# Altium schematic sheet 100_Power Supply.SchDoc: Power
size A4; SheetNumber: 3; SheetTotal: 7
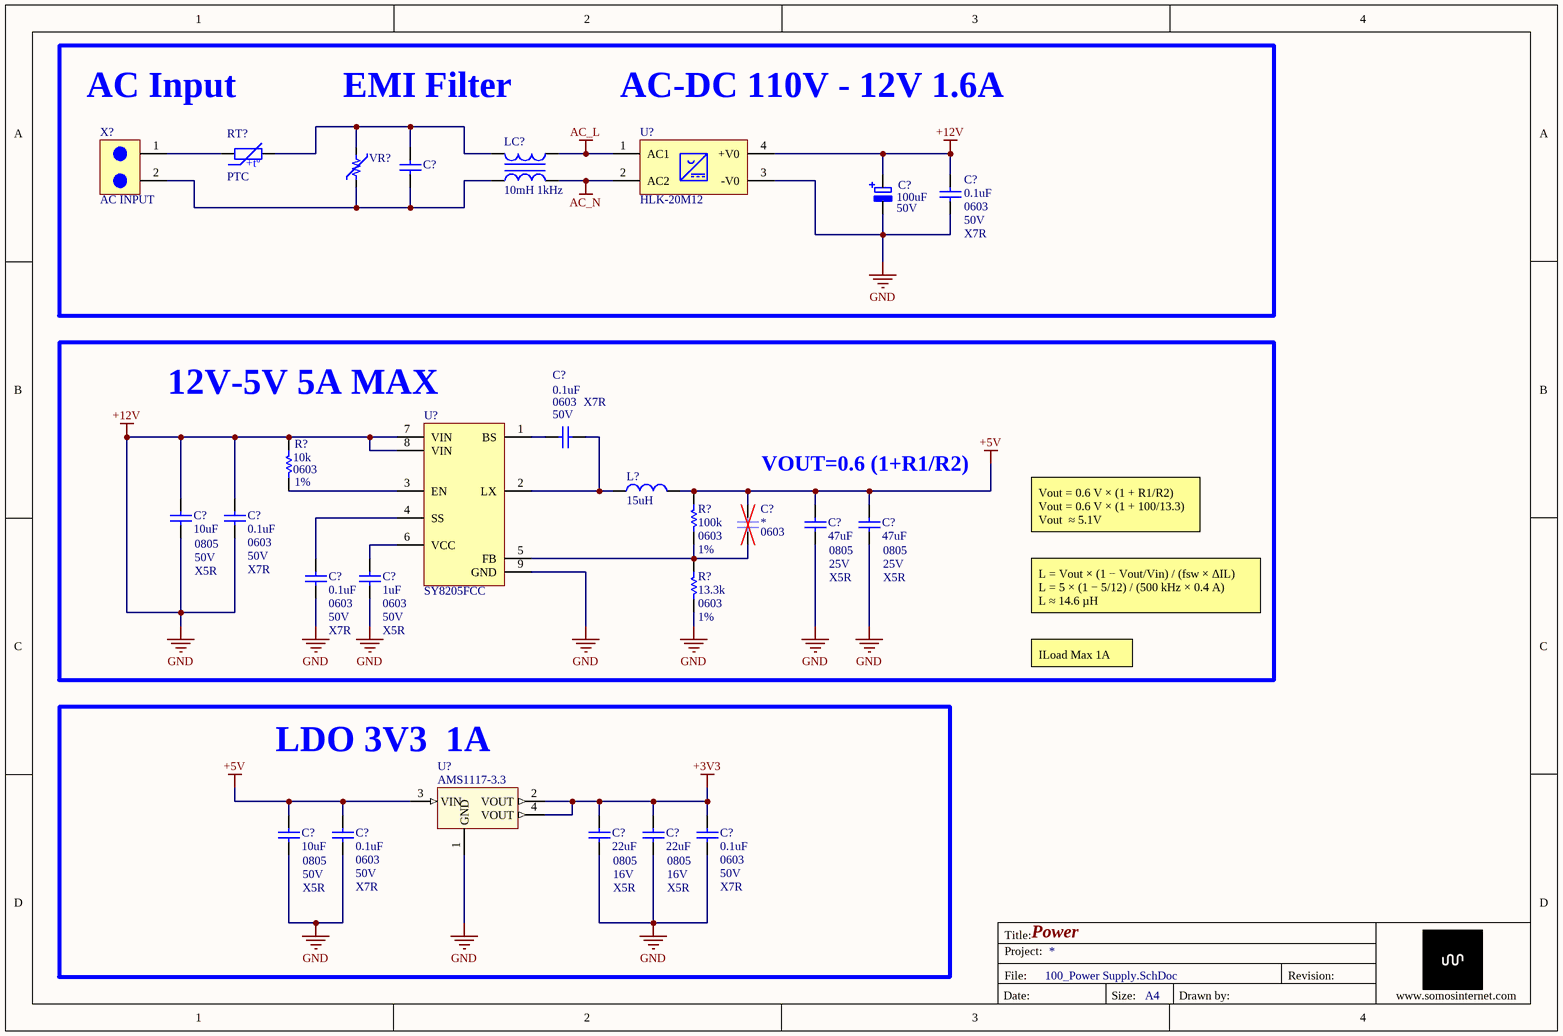
[diagram p0: 100_Power Supply.SchDoc]

## Parts
(Parts that share a designator on the sheet are numbered #1, #2 ... from top to bottom, then left to right.)
C?#1  C42Q322448P40001  [Safety Capacitor TH,P=10mm]  (value not drawn)
C?#2  0.1uF  PackageReference: 0603  Voltage: 50V  Temperature Coeficient: X7R  [CAPC1608X05N[0603]]
C?#3  100uF  Voltage: 50V  [CAP ALUM 8.3MM]
C?#4  0.1uF  PackageReference: 0603  Voltage: 50V  Temperature Coeficient: X7R  [CAPC1608X05N[0603]]
C?#5  0.1uF  PackageReference: 0603  Voltage: 50V  Temperature Coeficient: X7R  [CAPC1608X05N[0603]]
C?#6  *  PackageReference: 0603  [CAPC1608X05N[0603]]
C?#7  10uF  PackageReference: 0805  Voltage: 50V  Temperature Coeficient: X5R  [CAPC2012X05N[0805]]
C?#8  47uF  PackageReference: 0805  Voltage: 25V  Temperature Coeficient: X5R  [CAPC2012X05N[0805]]
C?#9  47uF  PackageReference: 0805  Voltage: 25V  Temperature Coeficient: X5R  [CAPC2012X05N[0805]]
C?#10  0.1uF  PackageReference: 0603  Voltage: 50V  Temperature Coeficient: X7R  [CAPC1608X05N[0603]]
C?#11  1uF  PackageReference: 0603  Voltage: 50V  Temperature Coeficient: X5R  [CAPC1608X05N[0603]]
C?#12  0.1uF  PackageReference: 0603  Voltage: 50V  Temperature Coeficient: X7R  [CAPC1608X05N[0603]]
C?#13  0.1uF  PackageReference: 0603  Voltage: 50V  Temperature Coeficient: X7R  [CAPC1608X05N[0603]]
C?#14  10uF  PackageReference: 0805  Voltage: 50V  Temperature Coeficient: X5R  [CAPC2012X05N[0805]]
C?#15  22uF  PackageReference: 0805  Voltage: 16V  Temperature Coeficient: X5R  [CAPC2012X05N[0805]]
C?#16  22uF  PackageReference: 0805  Voltage: 16V  Temperature Coeficient: X5R  [CAPC2012X05N[0805]]
L?  15uH  [SRN5020TA]
LC?  value 10mH 1kHz  [LC_10mH_1kHz_0.7A]  (hidden comment: PDUUAT98-103MLN)
R?#1  10k  PackageReference: 0603  Tolerance: 1%  [RESC1608X05N[0603]]
R?#2  100k  PackageReference: 0603  Tolerance: 1%  [RESC1608X05N[0603]]
R?#3  13.3k  PackageReference: 0603  Tolerance: 1%  [RESC1608X05N[0603]]
RT?  PTC  [POLYSW200-5638-310]
U?#1  HLK-20M12  [DIP,56x32mm]
U?#2  SY8205FCC  [SOIC127P600X160_HS-9N]
U?#3  AMS1117-3.3  [4-SOT_223]
VR?  175VAC 2.5kA  [Varistor FTR10D271K]  (value not drawn)
X?  AC INPUT  [TH,Right Angle,P=5mm]

## Blocks framed on the sheet
12V-5V 5A MAX: C?#4-C?#11 L? R?#1-R?#3 U?#2
LDO 3V3  1A: C?#12-C?#16 U?#3

## Nets
+3V3: C?#13.1 C?#15.2 C?#16.2 U?#3.2(VOUT) U?#3.4(VOUT)
+5V: C?#6.2 C?#8.2 C?#9.2 C?#12.1 C?#14.2 L?.2 R?#2.2 U?#3.3(VIN)
+12V: C?#2.1 C?#2.2 C?#3.+ C?#3.- C?#5.1 C?#5.2 C?#7.1 C?#7.2 C?#8.1 C?#9.1 C?#10.2 C?#11.1 C?#12.2 C?#13.2 C?#14.1 C?#15.1 C?#16.1 R?#1.2 R?#3.1 U?#1.3(-V0) U?#1.4(+V0) U?#2.7(VIN) U?#2.8(VIN) U?#2.9(GND) U?#3.1(GND)  [also labelled GND]
AC_L: LC?.4 U?#1.1(AC1)
AC_N: LC?.3 U?#1.2(AC2)
NetC?#1_1: C?#1.1 LC?.2 VR?.1 X?.2
NetC?#1_2: C?#1.2 LC?.1 RT?.2 VR?.2
NetC?#4_1: C?#4.1 L?.1 U?#2.2(LX)
NetC?#4_2: C?#4.2 U?#2.1(BS)
NetC?#6_1: C?#6.1 R?#2.1 R?#3.2 U?#2.5(FB)
NetC?#10_1: C?#10.1 U?#2.4(SS)
NetC?#11_2: C?#11.2 U?#2.6(VCC)
NetR?#1_1: R?#1.1 U?#2.3(EN)
NetRT?_1: RT?.1 X?.1

## Notes on the sheet
- AC Input
- EMI Filter
- (near U?#1) AC-DC 110V - 12V 1.6A
- (near C?#9) VOUT=0.6 (1+R1/R2)
- Vout = 0.6 V × (1 + R1/R2)
  Vout = 0.6 V × (1 + 100/13.3)
  Vout  ≈ 5.1V
- L = Vout × (1 − Vout/Vin) / (fsw × ΔIL)
  L = 5 × (1 − 5/12) / (500 kHz × 0.4 A)
  L ≈ 14.6 µH
- ILoad Max 1A
- Title:
- Project:
- File:
- Revision:
- Date:
- Size:
- A4
- Drawn by:
- www.somosinternet.com <http://www.somosinternet.com>
- (in symbol PTC) +tº

## Library data of the parts
C?#1 = Safety Capacitor C42Q322448P40001: CAP SAFETY 220nF ±10% 275V 310V TH; Manufacturer: WALSON; Manufacturer Part Number: C42Q322448P40001; Supplier 1: LCSC; Supplier Part Number 1: C46638866; ComponentLink1Description: LCSC; ComponentLink1URL: https://www.lcsc.com/product-detail/C46638866.html
C?#2 C?#4 C?#5 C?#10-C?#13 = CAP-generic: Chip Ceramic Capacitor SMD; Populated: Yes; Manuf1: *; Manuf2: *; Manuf1Partnumber: *; Manuf2Partnumber: *; ClassName: *; ROHS: Yes; LifeCycle: Checked; HelpURL: *
  C?#2 C?#4 C?#5 C?#10 C?#12 C?#13: Value: 0.1uF; LCSC: C113803
  C?#11: Value: 1uF; Supplier 1: DigiKey; Supplier Part Number 1: 490-GRM155R61H105ME05DDKR-ND; LCSC: C128624
C?#3 = CAPPOL-generic: Polarized Capacitor SMD; Manufacturer: JIERR; Manufacturer Part Number: RV50V100M8X10; Populated: Yes; Value: 100uF; ClassName: *; ROHS: Yes; LifeCycle: Checked; HelpURL: *; Supplier 1: Digikey; Supplier Part Number 1: 493-9631-1-ND; LCSC: C48935390
C?#6 = DNP-CAP: (DNP) "Do Not Populate" Chip Ceramic Capacitor SMD; Populated: No; Value: *; Manuf1: *; Manuf2: *; Manuf1Partnumber: *; Manuf2Partnumber: *; ClassName: *; ROHS: Yes; LifeCycle: Checked; HelpURL: *; Voltage: *
C?#7 C?#14 = CAP-generic: Chip Ceramic Capacitor SMD; Manuf1: muRata; Manuf1Partnumber: GRM21BR61H106KE43L; Populated: Yes; Value: 10uF; Manuf2: *; Manuf2Partnumber: *; ClassName: *; ROHS: Yes; LifeCycle: Checked; HelpURL: *; LCSC: C440198
C?#8 C?#9 = CAP-generic: Chip Ceramic Capacitor SMD; Manuf1: Samsung Electro-Mechanics; Manuf1Partnumber: CL21A476MQYNNNE; Populated: Yes; Value: 47uF; Manuf2: *; Manuf2Partnumber: *; ClassName: *; ROHS: Yes; LifeCycle: Checked; HelpURL: *; LCSC: C16780
C?#15 C?#16 = CAP-generic: Chip Ceramic Capacitor SMD; Manuf1: Samsung Electro-Mechanics; Manuf1Partnumber: CL21A226MOQNNNE; Populated: Yes; Value: 22uF; Manuf2: *; Manuf2Partnumber: *; ClassName: *; ROHS: Yes; LifeCycle: Checked; HelpURL: *; LCSC: C98190
L? = SRN5020TA-120M: FIXED IND 12UH 1.4A 135 MOHM SMD; Manufacturer 1: cjiang; Manufacturer Part Number 1: FNR5020S150MT; Supplier 1: LCSC; ComponentLink1URL: https://www.lcsc.com/product-detail/C167939.html; ComponentLink1Description: LCSC; Supplier Part Number 1: C167939; Value: 15uH
LC? = LC_10mH_1kHz_0.7A: CMC 1.5A 2LN 1.4KOHM SMD; Manufacturer: PROD Tech; Manufacturer Part Number: PDUUAT98-103MLN; ComponentLink1Description: Digi-Key; ComponentLink1URL: https://www.digikey.com/en/products/detail/murata-electronics/DLW5BTH142TQ2L/7564115; Supplier 1: LCSC; Supplier Part Number 1: C2909797
R?#1 = RES-generic: Chip Resistor SMD; Populated: Yes; Value: 10k; Manuf1: *; Manuf2: *; Manuf1Partnumber: *; Manuf2Partnumber: *; ClassName: *; ROHS: Yes; LifeCycle: Checked; HelpURL: *; Power: *; Supplier 1: Digikey; Supplier Part Number 1: 1276-3431-1-ND; LCSC: C5139509
R?#2 = RES-generic: Chip Resistor SMD; Manuf1: YAGEO; Manuf1Partnumber: RC0603FR-07100KL; Populated: Yes; Value: 100k; Manuf2: *; Manuf2Partnumber: *; ClassName: *; ROHS: Yes; LifeCycle: Checked; HelpURL: *; Power: *; LCSC: C14675; ComponentLink1Description: LCSC; ComponentLink1URL: https://www.lcsc.com/product-detail/C14675.html?s_z=n_q_t_resistors
R?#3 = RES-generic: Chip Resistor SMD; Manuf1: FOJAN; Manuf1Partnumber: FRC0603F1332TS; Populated: Yes; Value: 13.3k; Manuf2: *; Manuf2Partnumber: *; ClassName: *; ROHS: Yes; LifeCycle: Checked; HelpURL: *; Power: *; LCSC: C2933140; ComponentLink1Description: LCSC; ComponentLink1URL: https://www.lcsc.com/product-detail/C2933140.html?s_z=n_q_t_resistors
RT? = PTC: PTC RESET FUSE 250V 145mA TH; Manufacturer: Jinrui; Manufacturer Part Number: JK250-145U; Supplier 1: LCSC; Supplier Part Number 1: C369131; ComponentLink1Description: LCSC; ComponentLink1URL: https://www.lcsc.com/product-detail/C369131.html
U?#1 = HLK-20M12: 20W Series of Ultra-compact Power Module; Manufacturer: HI-LINK; Manufacturer Part Number: HLK-20M12; Supplier: LCSC; Supplier Part Number: C465408; ComponentLink1Description: LCSC; ComponentLink1URL: https://www.lcsc.com/product-detail/C465408.html?s_z=n_q_HI-LINK%2520HLK-20M12
U?#2 = SY8205FCC: High Efficiency Fast Response, 5A, 30V Input Synchronous Step Down Regulator; Manufacturer: Silergy; Manufacturer Part Number: SY8205FCC; LCSC: C111875; ComponentLink1Description: LCSC Link; ComponentLink1URL: https://www.lcsc.com/product-detail/C111875.html?spm=wm.fly.bg.1.xh___wm.fly.tp.26.ml&lcsc_vid=RldZXlJfEVNXXwYAFFQKVFJeFlYKVlFWQlFfXl1WRQMxVlNeRldbU1NfQllZUzsOAxUeFF5JWBYZEEoKFBINSQcJGk4NBhADEA4cHktXR1NXSQwSGg0%3D
U?#3 = AMS1117-3.3: 1A LDO Voltage Regulator; Manufacturer: UMW; Manufacturer Part Number: AMS1117-3.3; Supplier 1: LCSC; Supplier Part Number 1: C347222; ComponentLink1Description: LCSC; ComponentLink1URL: https://www.lcsc.com/product-detail/C347222.html?s_z=n_q_p_Ams-117-3.3
VR? = Varistor FTR10D271K: VARISTOR 243V~297V 2.5kA P=7.5mm; Manufacturer: FTR; Manufacturer Part Number: FTR10D271K; Supplier 1: LCSC; Supplier Part Number 1: C693524; ComponentLink1Description: Digi-Key; ComponentLink1URL: https://www.lcsc.com/product-detail/C693524.html?s_z=n_q_C693524&globalKeyword=C693524
X? = TERMINAL BLOCK 2PIN 5mm: TERM BLOCK HDR 2POS 5MM; Manufacturer: Cixi Kefa Elec; Manufacturer Part number: KF2EDGRC-5.0-2P; Supplier: LCSC; Supplier Part Number 1: C441225; ComponentLink1Description: LCSC; ComponentLink1URL: https://www.lcsc.com/product-detail/C441225.html